# EasyEDA Pro project termómetro .eprj

# Schematic termómetro

## Sheets
1 P1: Board Name: Board1; Create Date: 2025-02-05; Page Name: P1; Project Name: termómetro; Schematic Name: Schematic1; Update Date: 2025-02-05; Company: EasyEDA.com; Page Size: A4; Version: V1.0
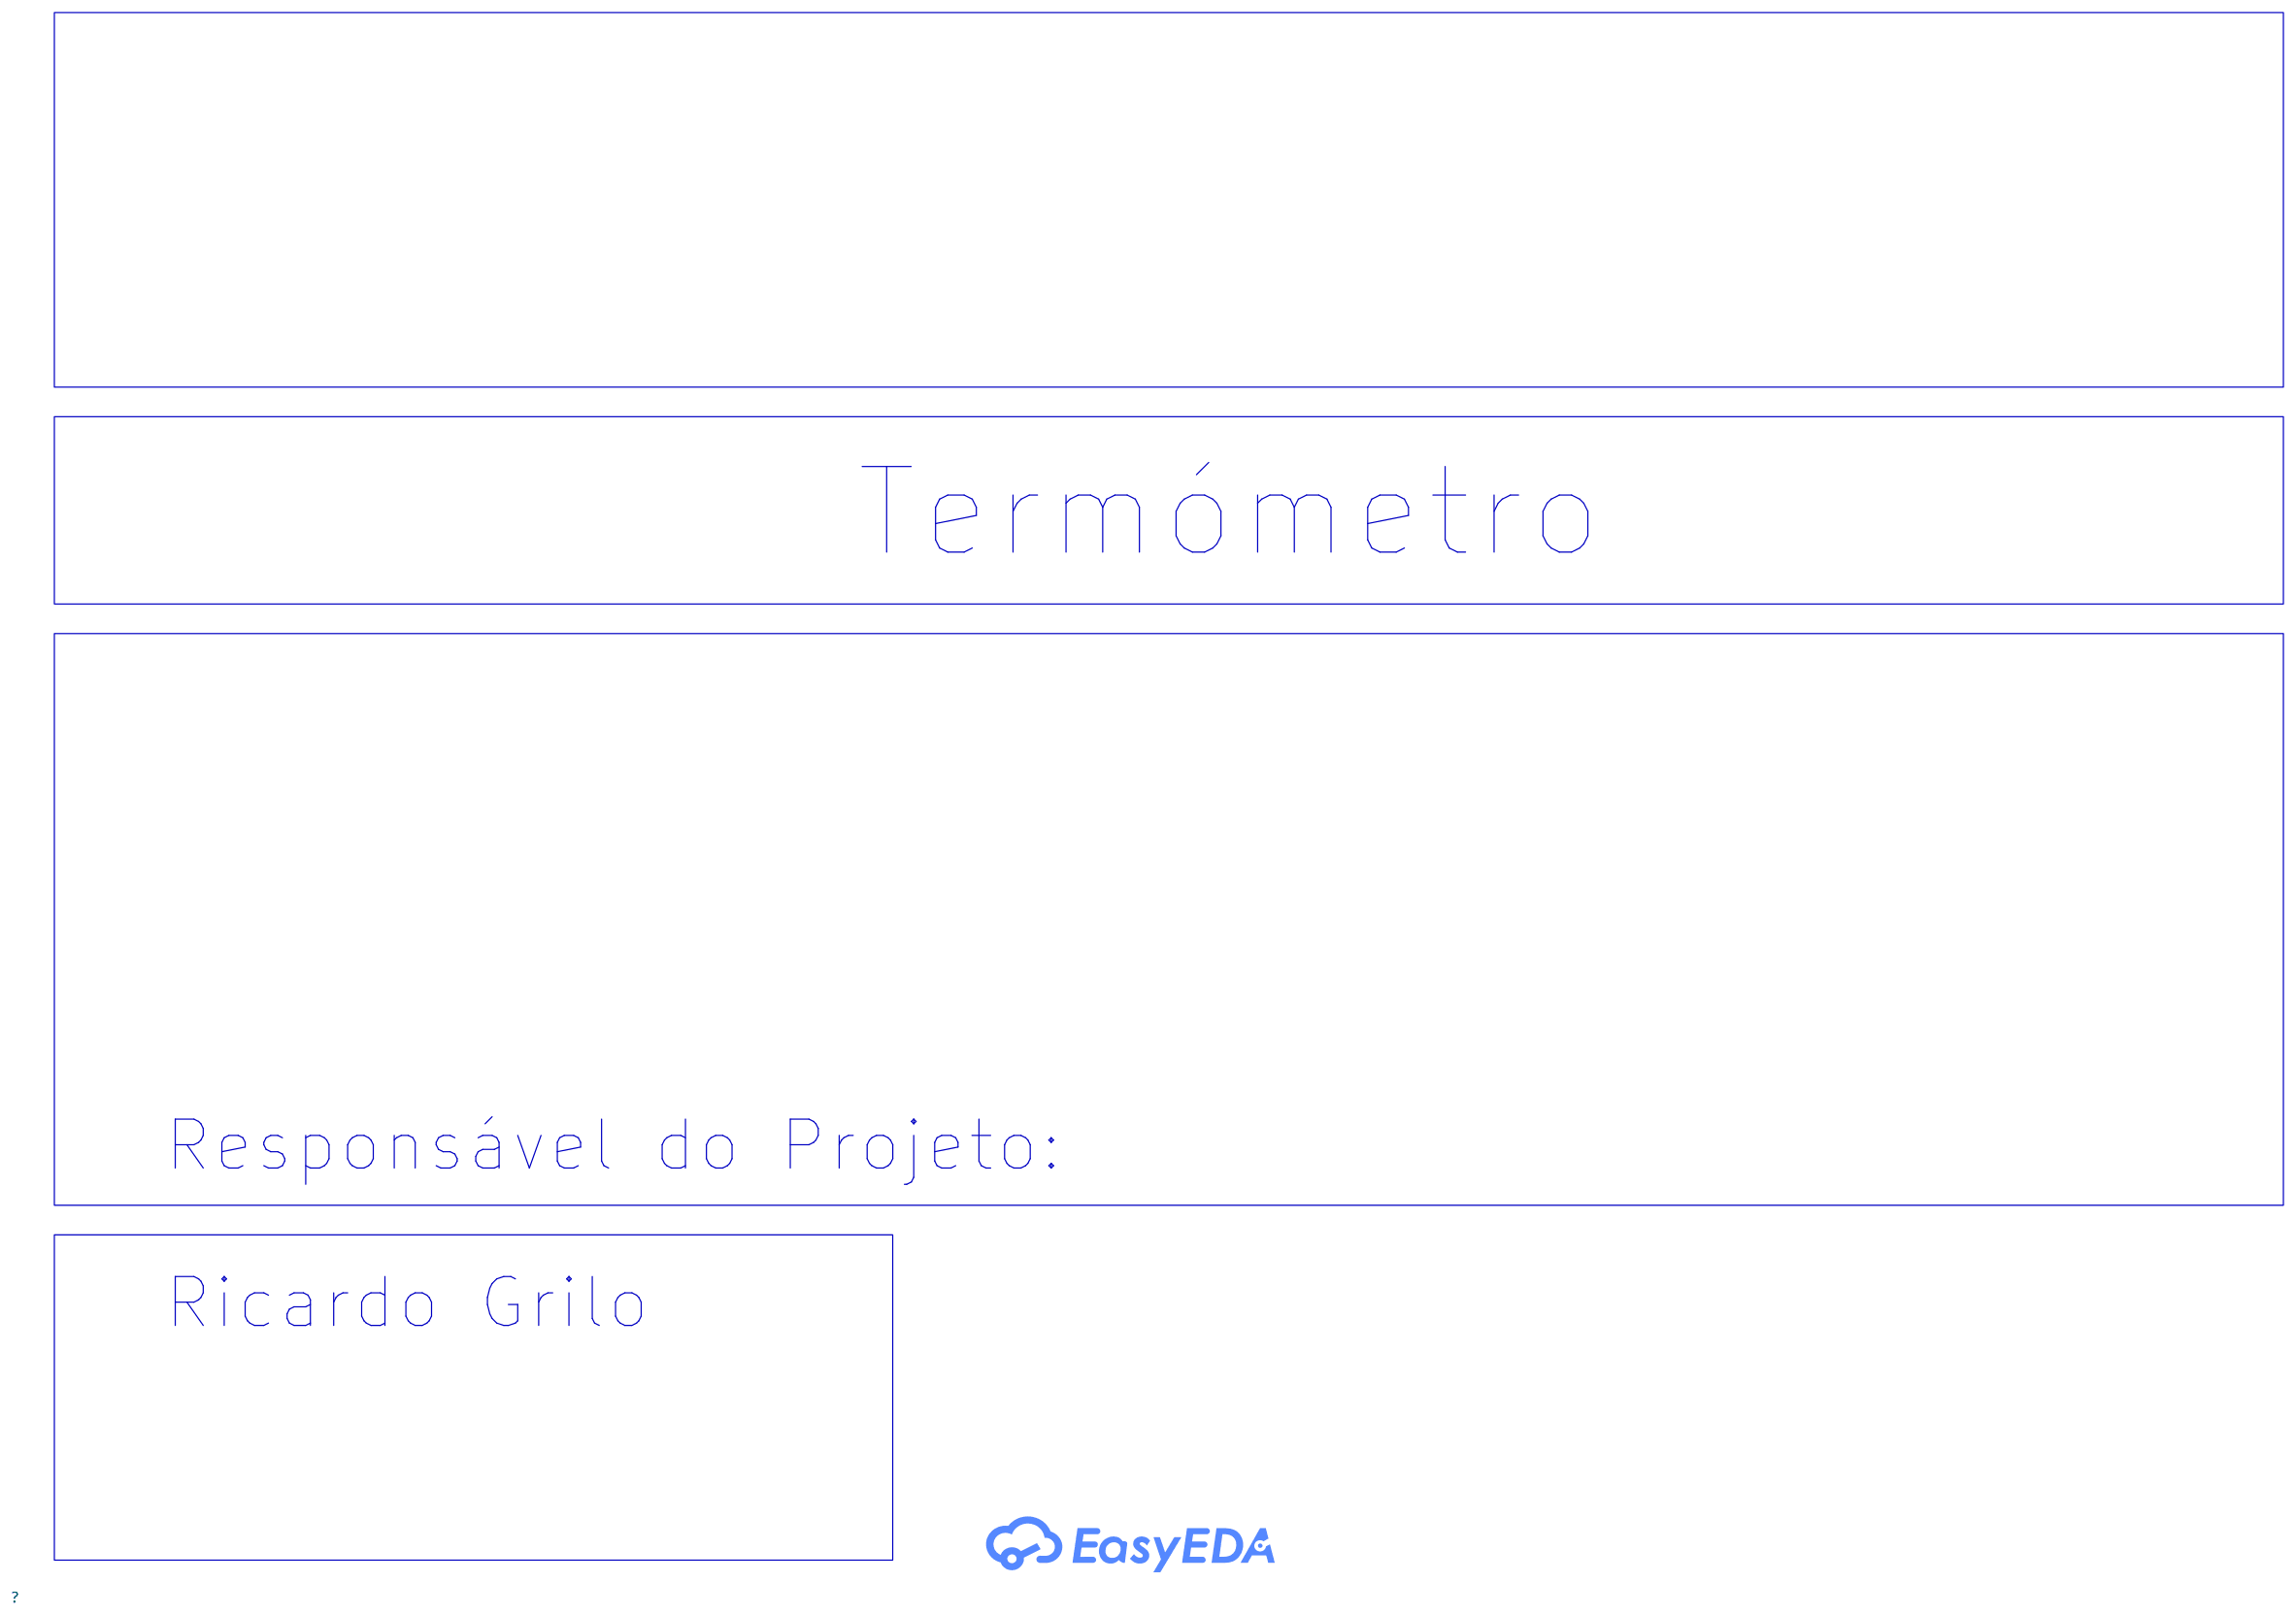
[diagram p0: P1]
2 P2: Page Name: P2; Schematic Name: arduino
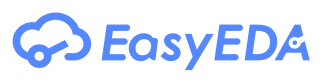
[diagram p1: P2]
3 P3: Page Name: P3; Schematic Name: arduino
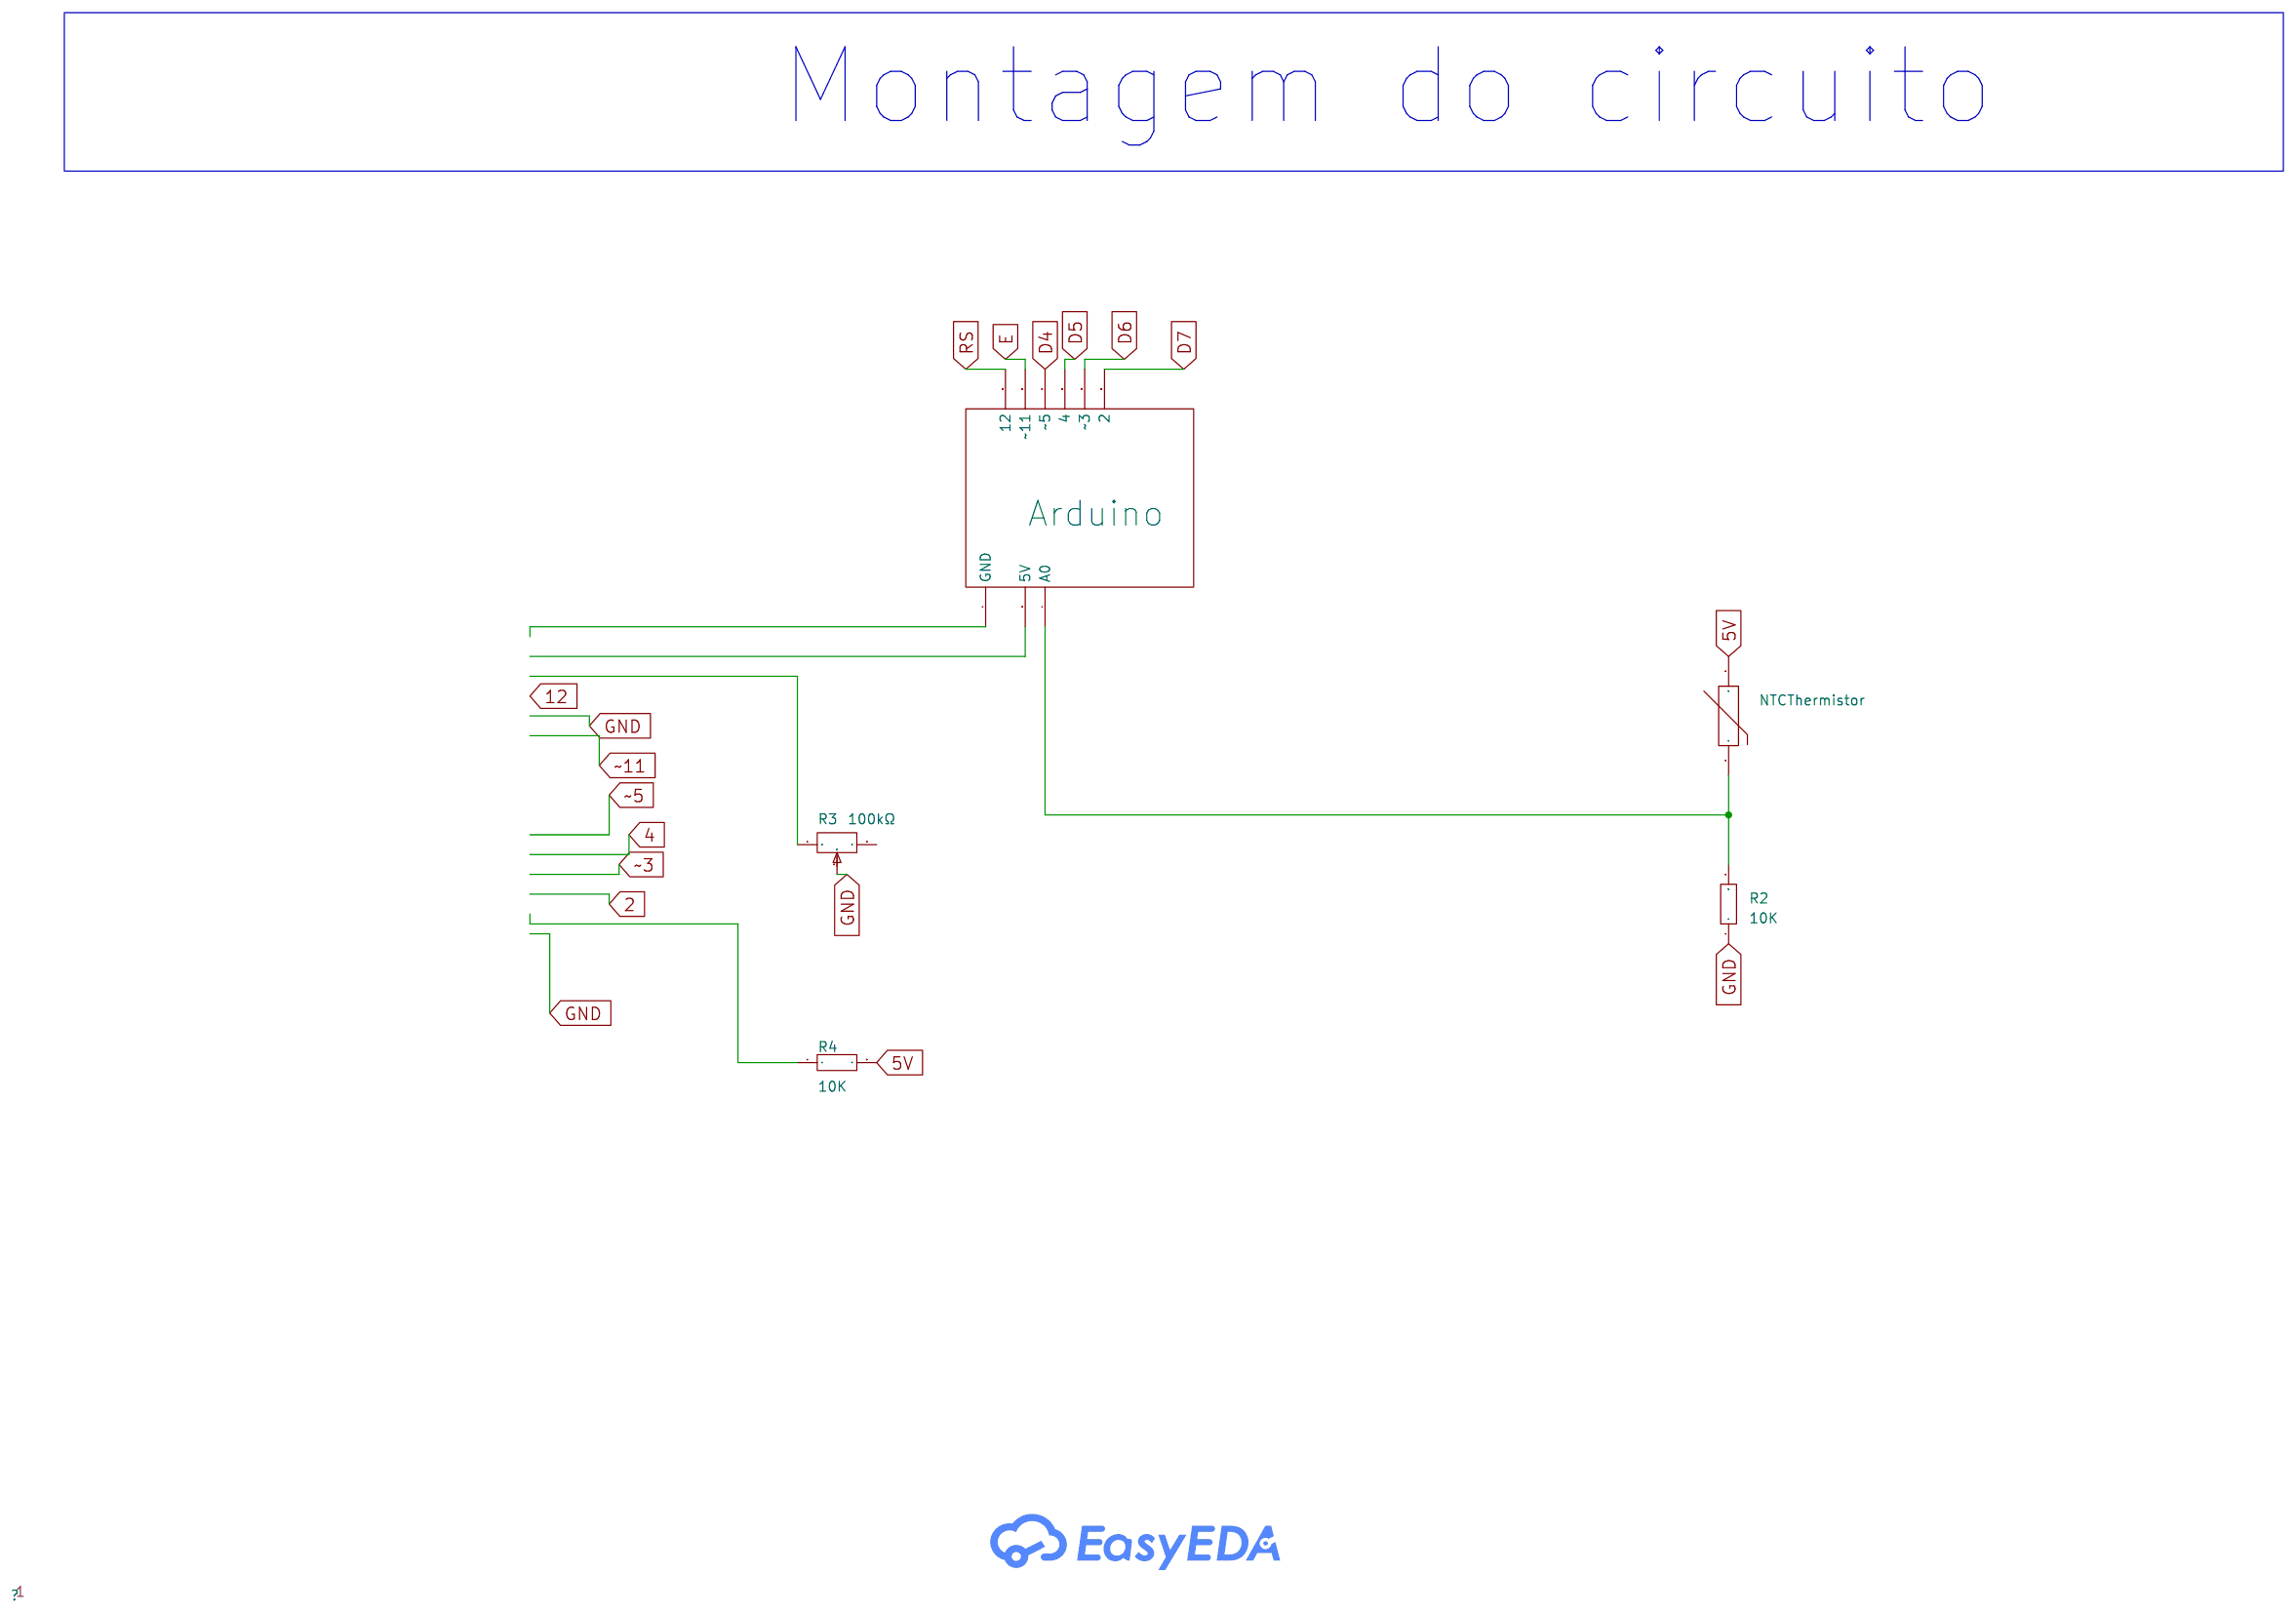
[diagram p2: P3]

## Parts
?#1  -
Arduino  -
NTCThermistor  -  [RES-TH_L17.5-W6.0-P7.50-D0.8-S5.20]
R2  10K  [R0603]
R3  100kΩ  [RES-ADJ-TH_3362P]
R4  10K  [R0603]

## Library data of the parts
Arduino = arduino simples
NTCThermistor = MF72 5D15: LCSC Part Name: 5Ω 电阻精度:±20% 3000K 功率型NTC; Supplier Part: C72690; Manufacturer: 时恒; Supplier Footprint: 径向引线,P=7.5mm; JLCPCB Part Class: Extended Part; Datasheet: https://atta.szlcsc.com/upload/public/pdf/source/20160507/1462613615903.pdf; Supplier: LCSC; Steady State Current (Max): 6A; Operating Temperature: -40℃~+200℃
R2 R4 = Res_0603: Supplier Footprint: 0603
R3 = 3362P-1-503LF: LCSC Part Name: 50kΩ ±10%; Supplier Part: C81264; Manufacturer: BOURNS; Supplier Footprint: 3362P; JLCPCB Part Class: Extended Part; Datasheet: https://atta.szlcsc.com/upload/public/pdf/source/20160823/1471947544322.pdf; Supplier: LCSC

## Nets
5V: NTCThermistor.2 R4.2
GND: ?#1.5(RW) ?#1.16(K) R2.1 R3.2
2: ?#1.14(D7)
4: ?#1.12(D5)
12: ?#1.4(RS)
D4: Arduino.11(~5)
D5: Arduino.10(4)
D6: Arduino.9(~3)
D7: Arduino.8(2)
E: Arduino.12(~11)
RS: Arduino.13(12)
~3: ?#1.13(D6)
~5: ?#1.11(D4)
~11: ?#1.6(E)
Net-(?#1-1): ?#1.1(Vss) Arduino.1(GND)
Net-(?#1-2): ?#1.2(VDD) Arduino.3(5V)
Net-(?#1-3): ?#1.3(V0) R3.1
Net-(?#1-15): ?#1.15(A) R4.1
Net-(Arduino-4): Arduino.4(A0) NTCThermistor.1 R2.2

Not connected (* = marked no-connect by the designer): ?#1 7(D0) 8(D1) 9(D2) 10(D3); R3 3

## Notes on the sheets
sheet 1
- Termómetro
- Responsável do Projeto:
  Ricardo Grilo
sheet 3
- Montagem do circuito
